# EAGLE schematic rel-eeprom-prog (EAGLE 9.1.3)
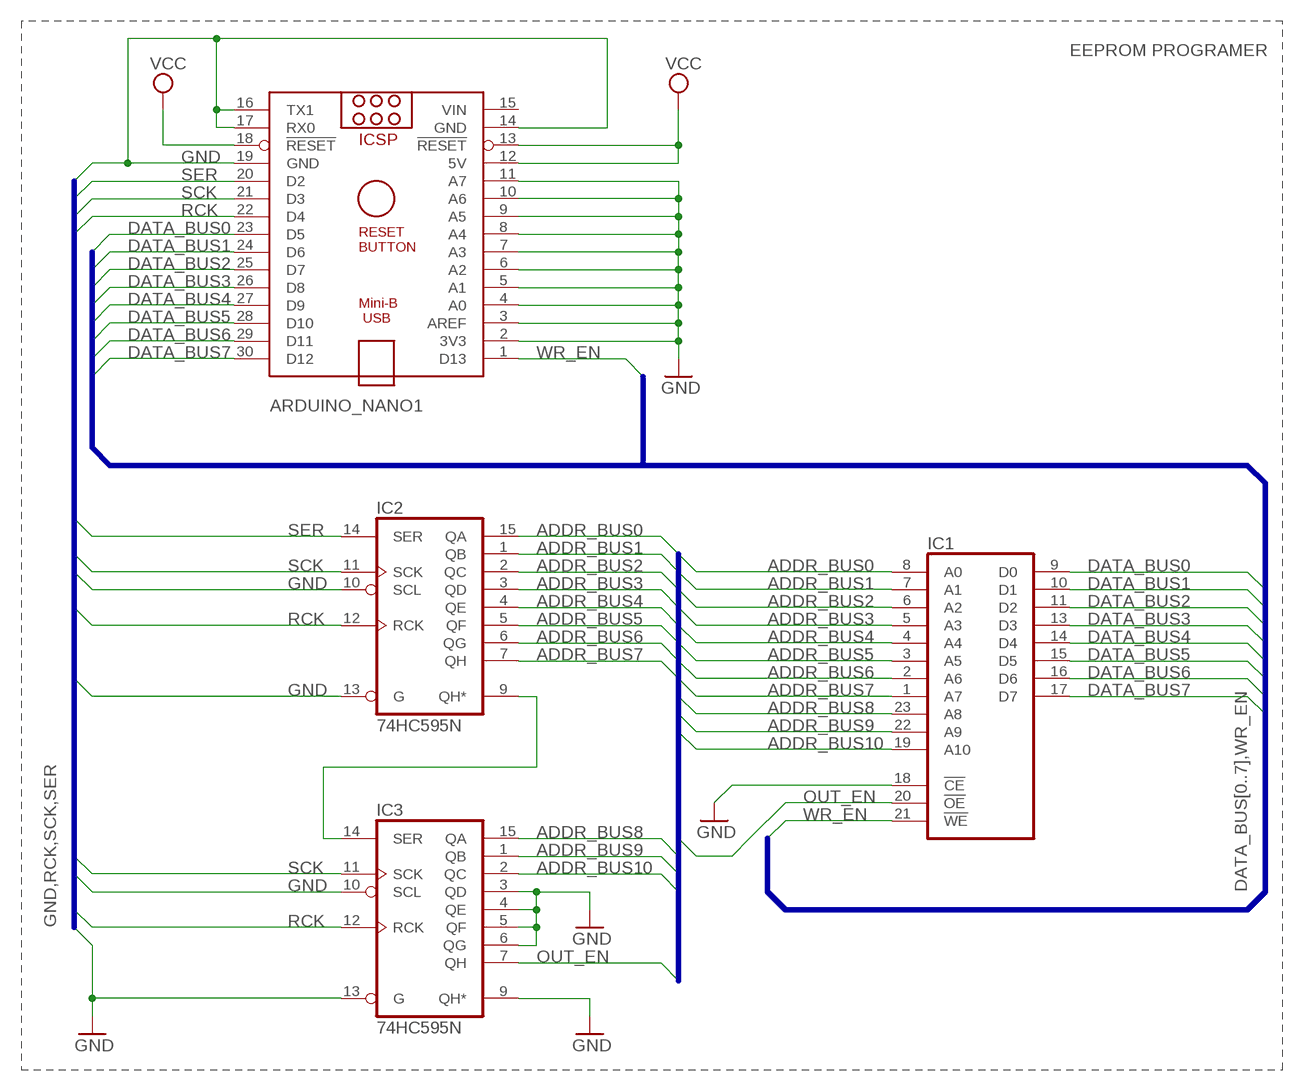
[diagram p0: schematic, sheet 1]

## Parts
ARDUINO_NANO1  ARDUINO_NANO  [ARDUINO_NANO]
IC1  2816  [DIL24]
IC2  74HC595N  [DIL16]
IC3  74HC595N  [DIL16]

## Nets
ADDR_BUS0: IC1.8(A0) IC2.15(QA)
ADDR_BUS1: IC1.7(A1) IC2.1(QB)
ADDR_BUS2: IC1.6(A2) IC2.2(QC)
ADDR_BUS3: IC1.5(A3) IC2.3(QD)
ADDR_BUS4: IC1.4(A4) IC2.4(QE)
ADDR_BUS5: IC1.3(A5) IC2.5(QF)
ADDR_BUS6: IC1.2(A6) IC2.6(QG)
ADDR_BUS7: IC1.1(A7) IC2.7(QH)
ADDR_BUS8: IC1.23(A8) IC3.15(QA)
ADDR_BUS9: IC1.22(A9) IC3.1(QB)
ADDR_BUS10: IC1.19(A10) IC3.2(QC)
DATA_BUS0: ARDUINO_NANO1.23(D5) IC1.9(D0)
DATA_BUS1: ARDUINO_NANO1.24(D6) IC1.10(D1)
DATA_BUS2: ARDUINO_NANO1.25(D7) IC1.11(D2)
DATA_BUS3: ARDUINO_NANO1.26(D8) IC1.13(D3)
DATA_BUS4: ARDUINO_NANO1.27(D9) IC1.14(D4)
DATA_BUS5: ARDUINO_NANO1.28(D10) IC1.15(D5)
DATA_BUS6: ARDUINO_NANO1.29(D11) IC1.16(D6)
DATA_BUS7: ARDUINO_NANO1.30(D12) IC1.17(D7)
GND: ARDUINO_NANO1.2(3V3) ARDUINO_NANO1.3(AREF) ARDUINO_NANO1.4(A0) ARDUINO_NANO1.5(A1) ARDUINO_NANO1.6(A2) ARDUINO_NANO1.7(A3) ARDUINO_NANO1.8(A4) ARDUINO_NANO1.9(A5) ARDUINO_NANO1.10(A6) ARDUINO_NANO1.11(A7) ARDUINO_NANO1.14(GND) ARDUINO_NANO1.16(TX1) ARDUINO_NANO1.17(RX0) ARDUINO_NANO1.19(GND) IC1.18(!CE) IC2.10(SCL) IC2.13(G) IC3.3(QD) IC3.4(QE) IC3.5(QF) IC3.6(QG) IC3.9(QH*) IC3.10(SCL) IC3.13(G)
N$17: IC2.9(QH*) IC3.14(SER)
OUT_EN: IC1.20(!OE) IC3.7(QH)
RCK: ARDUINO_NANO1.22(D4) IC2.12(RCK) IC3.12(RCK)
SCK: ARDUINO_NANO1.21(D3) IC2.11(SCK) IC3.11(SCK)
SER: ARDUINO_NANO1.20(D2) IC2.14(SER)
VCC: ARDUINO_NANO1.12(5V) ARDUINO_NANO1.13(!RESET) ARDUINO_NANO1.18(!RESET)
WR_EN: ARDUINO_NANO1.1(D13) IC1.21(!WE)

## Buses
GND,RCK,SCK,SER
ADDR_BUS[0..10],OUT_EN
DATA_BUS[0..7],WR_EN

## Notes on the sheet
- EEPROM PROGRAMER

## Power pins joined to a net without a drawn wire
GND: IC1.12(GND) IC2.8(GND) IC3.8(GND)
VCC: IC1.24(VCC) IC2.16(VCC) IC3.16(VCC)
VIN: ARDUINO_NANO1.15(VIN)

## Library data of the parts
ARDUINO_NANO1 = ArduinoNanoV30:ARDUINO_NANO: Arduino Nano V3.0 Overview: The Arduino Nano is a small, complete, and breadboard-friendly board based on the ATmega328 (Arduino Nano 3.x) or ATmega168 (Arduino Nano 2.x). It has more or less the same functionality of the Arduino Duemilanove, but in a different package. It lacks only a DC power jack, and works with a Mini-B USB cable instead of a standard one. The Nano was designed and is being produced by Gravitech. Specifications: Microcontroller Atmel ATmega168 or ATmega328 Operating Voltage (logic level) 5 V Input Voltage (recommended) 7-12 V Input Voltage (limits) 6-20 V Digital I/O Pins 14 (of which 6 provide PWM output) Analog Input Pins 8 DC Current per I/O Pin 40 mA Flash Memory 16 KB (ATmega168) or 32 KB (ATmega328) of which 2 KB used by bootloader SRAM 1 KB (ATmega168) or 2 KB (ATmega328) EEPROM 512 bytes (ATmega168) or 1 KB (ATmega328) Clock Speed 16 MHz Dimensions 0.73" x 1.70" Length 45 mm Width 18 mm Weigth 5 g Power: The Arduino Nano can be powered via the Mini-B USB connection, 6-20V unregulated external power supply (pin 30), or 5V regulated external power supply (pin 27). The power source is automatically selected to the highest voltage source. Memory: The ATmega168 has 16 KB of flash memory for storing code (of which 2 KB is used for the bootloader); the ATmega328 has 32 KB, (also with 2 KB used for the bootloader). The ATmega168 has 1 KB of SRAM and 512 bytes of EEPROM (which can be read and written with the EEPROM library); the ATmega328 has 2 KB of SRAM and 1 KB of EEPROM. Input and Output: Each of the 14 digital pins on the Nano can be used as an input or output, using pinMode(), digitalWrite(), and digitalRead() functions. They operate at 5 volts. Each pin can provide or receive a maximum of 40 mA and has an internal pull-up resistor (disconnected by default) of 20-50 kOhms. In addition, some pins have specialized functions. Visit Arduino - ArduinoBoardNano <https://www.arduino.cc/en/Main/ArduinoBoardNano>
IC1 = memory:2816: MEMORY
IC2 IC3 = 74xx-eu:74*595: 8-bit SHIFT REGISTER, output latch